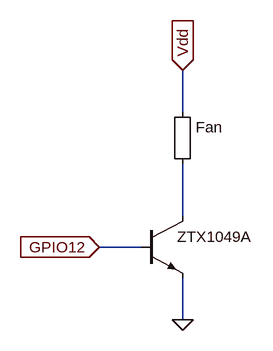
[diagram p0: schematic report 5.asc]
report 5.asc, the LTspice schematic file:
Version 4
SHEET 1 880 680
WIRE 240 -48 240 -112
WIRE 240 112 240 32
WIRE 176 160 112 160
WIRE 240 272 240 208
FLAG 240 272 0
FLAG 112 160 GPIO12
IOPIN 112 160 In
FLAG 240 -112 Vdd
IOPIN 240 -112 In
SYMBOL npn 176 112 R0
SYMATTR InstName ZTX1049A
SYMATTR Value ""
SYMBOL Misc\\EuropeanResistor 224 -64 R0
SYMATTR InstName Fan
SYMATTR Value ""

The netlist it stands for:
* report 5.asc
Q§ZTX1049A N001 GPIO12 0 0
R§Fan Vdd N001
.model NPN NPN
.model PNP PNP
.lib standard.bjt
.backanno
.end